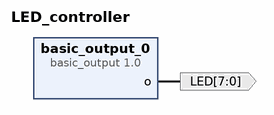
[diagram p0: block diagram of the top level]
# Vivado block design LED_controller, xc7a35tcpg236-1, Vivado 2025.1
create_bd_design LED_controller

create_bd_port -dir O -from 7 -to 0 -type data LED

create_bd_cell -type ip -vlnv xilinx.com:hls:basic_output:1.0 basic_output_0

# ---- connections ----

connect_bd_net [get_bd_pins basic_output_0/o] [get_bd_ports LED]

validate_bd_design
save_bd_design
